# EAGLE design 2in-2out_1.0c (EAGLE 5.05)
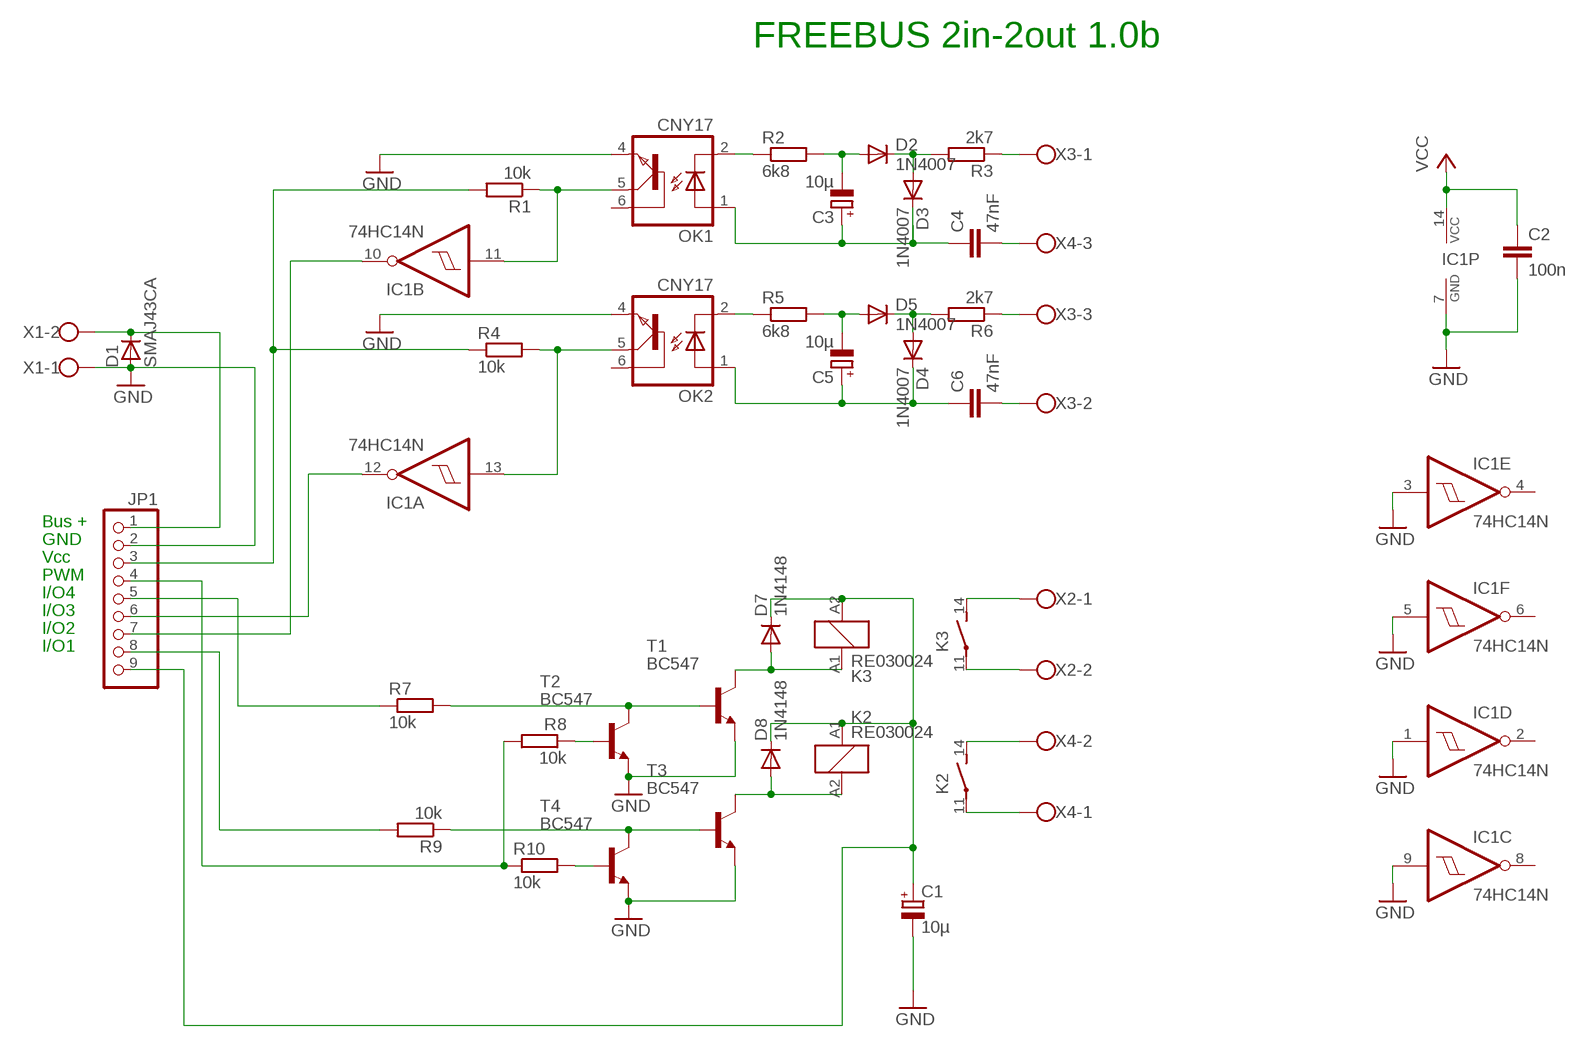
[diagram p0: schematic, sheet 1]

## Parts
C1  10µ  CPOL-EUE3.5-8  [E3,5-8]
C2  100n  C-EU025-024X044  [C025-024X044]
C3  10µ  CPOL-EUE2-4  [E2-4]
C4  47nF  C-EU075-063X106  [C075-063X106]
C5  10µ  CPOL-EUE2-4  [E2-4]
C6  47nF  C-EU075-063X106  [C075-063X106]
D1  SMAJ43CA  D-SMB  [SMB]
D2  1N4007  DIODE-D-2.5  [D-2.5]
D3  1N4007  DIODE-D-2.5  [D-2.5]
D4  1N4007  DIODE-D-2.5  [D-2.5]
D5  1N4007  DIODE-D-2.5  [D-2.5]
D7  1N4148  1N4148STEHEND  [D-2.5]
D8  1N4148  1N4148STEHEND  [D-2.5]
IC1  74HC14N  [DIL14]
JP1  PINHD-1X9  [1X09]
K2  RE030024  [RE-SCHRACK]
K3  RE030024  [RE-SCHRACK]
OK1  CNY17  [DIL06]
OK2  CNY17  [DIL06]
R1  10k  R-EU_0207/10  [0207/10]
R2  6k8  R-EU_0207/2V  [0207/2V]
R3  2k7  R-EU_0207/2V  [0207/2V]
R4  10k  R-EU_0207/2V  [0207/2V]
R5  6k8  R-EU_0207/2V  [0207/2V]
R6  2k7  R-EU_0207/2V  [0207/2V]
R7  10k  R-EU_0207/2V  [0207/2V]
R8  10k  R-EU_0207/2V  [0207/2V]
R9  10k  R-EU_0207/2V  [0207/2V]
R10  10k  R-EU_0207/10  [0207/10]
T1  BC547  [TO92]
T2  BC547  [TO92]
T3  BC547  [TO92]
T4  BC547  [TO92]
X1  W237-02P  [W237-132]
X2  W237-02P  [W237-132]
X3  W237-3E  [W237-3E]
X4  W237-3E  [W237-3E]

## Nets
GND: C1.- C2.2 D1.2(A) IC1.1(D:I) IC1.3(E:I) IC1.5(F:I) IC1.7(P:GND) IC1.9(C:I) JP1.2 OK1.4(EMI) OK2.4(EMI) T1.1(E) T2.1(E) T3.1(E) T4.1(E) X1.1
IO1: JP1.8 R9.2
IO2: IC1.10(B:O) JP1.7
IO3: IC1.12(A:O) JP1.6
IO4: JP1.5 R7.1
N$1: OK1.2(C) R2.1
N$2: K3.11(2:P) X2.2
N$3: C3.- D2.A R2.2
N$4: D1.1(C) JP1.1 X1.2
N$5: D2.C D3.A R3.2
N$6: K3.14(2:S) X2.1
N$8: K2.14(2:S) X4.2
N$9: K2.11(2:P) X4.1
N$10: OK2.2(C) R5.1
N$11: R6.1 X3.3
N$13: C5.- D5.A R5.2
N$14: R7.2 T1.2(B) T2.3(C)
N$15: R3.1 X3.1
N$17: R9.1 T3.2(B) T4.3(C)
N$18: D4.A D5.C R6.2
N$19: D8.A K2.A2 T3.3(C)
N$20: C5.+ C6.1 D4.C OK2.1(A)
N$21: R8.1 T2.2(B)
N$22: R10.2 T4.2(B)
N$23: C6.2 X3.2
N$24: C3.+ C4.1 D3.C OK1.1(A)
N$25: C4.2 X4.3
N$28: IC1.13(A:I) OK2.5(COL) R4.2
N$29: IC1.11(B:I) OK1.5(COL) R1.1
PWM: JP1.4 R8.2 R10.1
R3: D7.A K3.A1 T1.3(C)
VCC: C2.1 IC1.14(P:VCC) JP1.3 R1.2 R4.1
VDD_IN: C1.+ D7.C D8.C JP1.9 K2.A1 K3.A2
Unconnected: IC1.2(D:O) IC1.4(E:O) IC1.6(F:O) IC1.8(C:O) OK1.6(BAS) OK2.6(BAS)

## Notes on the sheet
- FREEBUS 2in-2out 1.0b
- Bus +
- GND
- Vcc
- PWM
- I/O4
- I/O3
- I/O2
- I/O1

## Library data of the parts
C1 C3 C5 = rcl:CPOL-EU: POLARIZED CAPACITOR, European symbol
C2 C4 C6 = rcl:C-EU: CAPACITOR, European symbol
D1 = semicon-smd-ipc:D-: DIODE unfilled
D2-D5 = diode:DIODE-: DIODE
D7 D8 = diode:1N4148: DIODE high speed (Philips)
IC1 = 74xx-eu:74*14: Hex schmitt trigger INVERTER
JP1 = pinhead:PINHD-1X9: PIN HEADER
K2 K3 = relay:RE03*: Miniature PCB Relay 1 pole 6 A SCHRACK Source: http://www.schrack.com/.. 5812.pdf
OK1 OK2 = optocoupler:CNY17: SIEMENS OPTO COUPLER
R1-R10 = rcl:R-EU_: RESISTOR, European symbol
T1-T4 = transistor-npn:BC547*: NPN Transistor
X1 X2 = con-wago-508:W237-02P: WAGO SREW CLAMP
X3 X4 = con-wago-508:W237-3E: WAGO SREW CLAMP

## Board
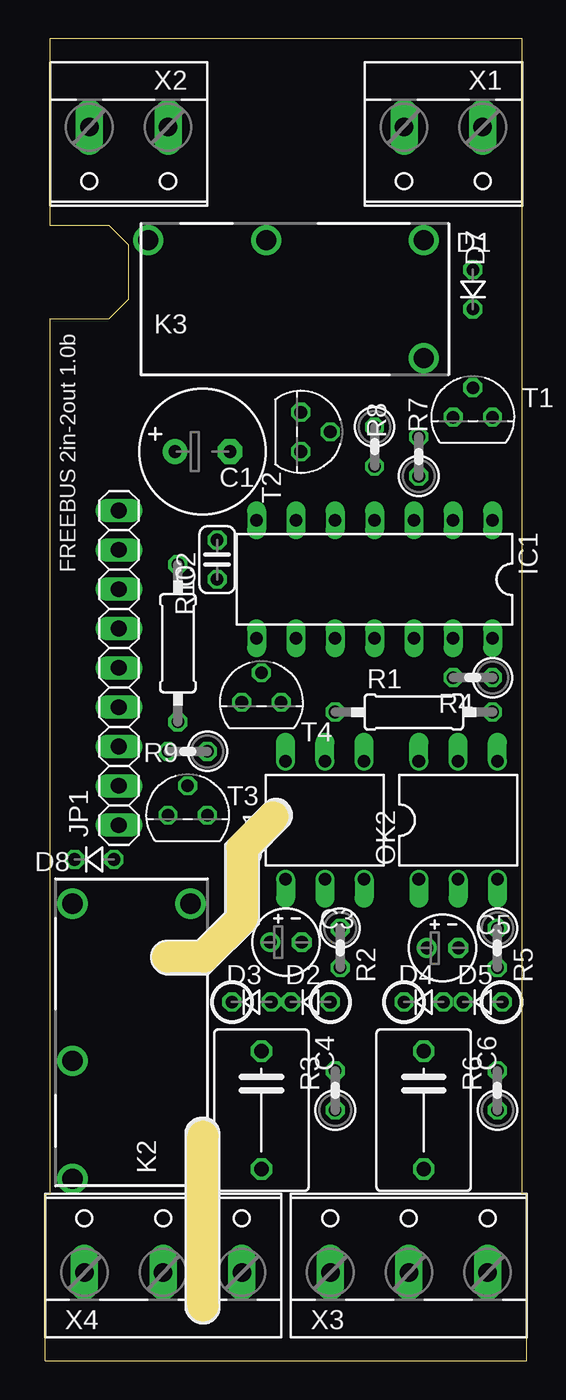
[diagram p1: board, top side]
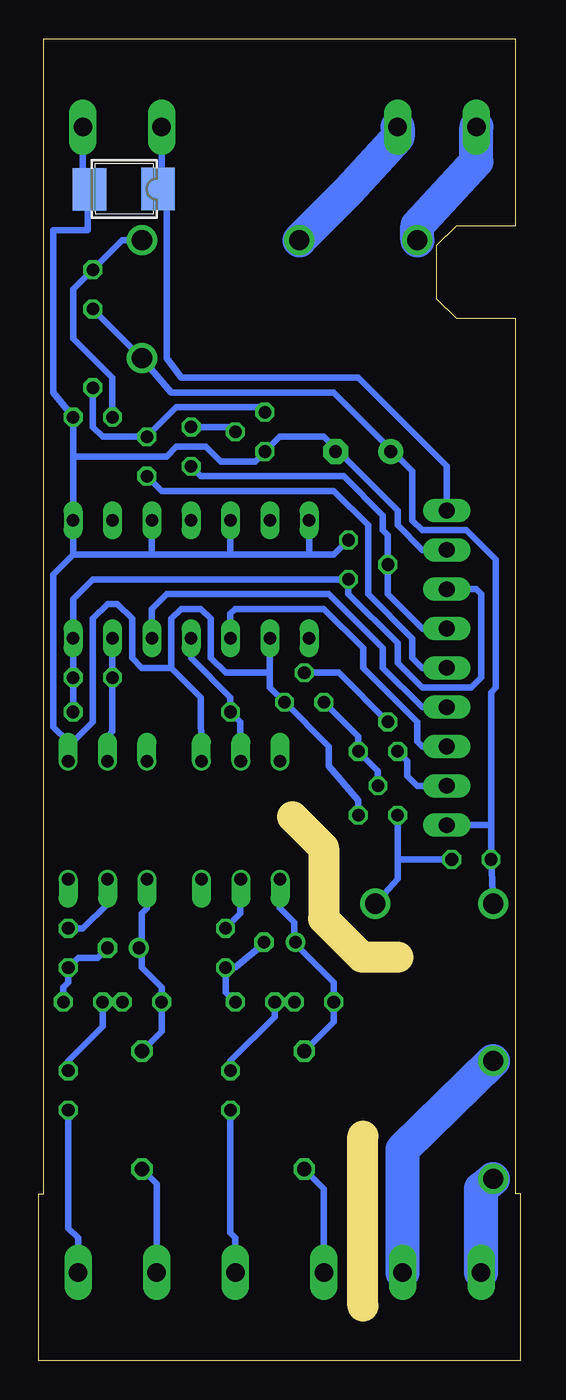
[diagram p2: board, bottom side, seen from below]

Size 31.11 x 85.41 mm. Coordinates in mm from the lower left corner, seen from the top.
Outline: 0,0 0,10.79 0.32,10.79 0.32,67.31 4.13,67.31 5.4,68.58 5.4,72.07 4.13,73.34 0.32,73.34 0.32,85.41 30.8,85.41 30.8,10.79 31.11,10.79 31.11,0 0,0
Copper layers (1*16): Top 0.035mm / dielectric 1.5mm / Bottom 0.035mm
Design rules "ZWILLING": minimum track width 0.2mm, minimum drill 0.5mm, track to track 0.2mm, track to pad 0.2mm, pad to pad 0.2mm, via to via 0.2mm, smd to smd 0mil, copper to edge 0.2mm, drill to drill 0.2mm, minimum pad ring 0.2mm, minimum via ring 0.2mm, stop-mask expansion 0.1mm, vias tented up to drill 0mil, thermal gap 10mil
Milling: 5 lines

### Footprints (pad centres in the part's own frame; a part is rotated, then mirrored left to right if it is on the bottom)
E3,5-8 = drill 0.813 pad 1.6 round: + -1.778,0 | drill 0.813 pad 1.6 octagon: - 1.778,0
C025-024X044 = drill 0.813 octagon: 1 -1.27,0; 2 1.27,0
E2-4 = drill 0.813 pad 1.27 round: + -1.016,0 | drill 0.813 pad 1.27 octagon: - 1.016,0
C075-063X106 = drill 0.914 octagon: 1 -3.81,0; 2 3.81,0
SMB = smd 2.159 x 2.743: 1 -2.311,-0.127; 2 2.108,-0.102
D-2.5 = drill 0.813 octagon: A 1.27,0; C -1.27,0
DIL14 = drill 0.813 long: 1 -7.62,-3.81; 2 -5.08,-3.81; 3 -2.54,-3.81; 4 0,-3.81; 5 2.54,-3.81; 6 5.08,-3.81; 7 7.62,-3.81; 8 7.62,3.81; 9 5.08,3.81; 10 2.54,3.81; 11 0,3.81; 12 -2.54,3.81; 13 -5.08,3.81; 14 -7.62,3.81
1X09 = drill 1.016 long: 1 -10.16,0; 2 -7.62,0; 3 -5.08,0; 4 -2.54,0; 5 0,0; 6 2.54,0; 7 5.08,0; 8 7.62,0; 9 10.16,0
RE-SCHRACK = drill 1.3 round: 11 8.89,-3.81; 14 1.27,-3.81; A1 -8.89,-3.81; A2 -8.89,3.81
DIL06 = drill 0.813 offset: 1 -2.54,-3.81; 2 0,-3.81; 3 2.54,-3.81; 4 2.54,3.81; 5 0,3.81; 6 -2.54,3.81
0207/10 = drill 0.813 octagon: 1 -5.08,0; 2 5.08,0
0207/2V = drill 0.813 octagon: 1 -1.27,0; 2 1.27,0
TO92 = drill 0.813 octagon: 1 1.27,0; 2 0,1.905; 3 -1.27,0
W237-132 = drill 1.194 long: 1 -2.54,-0.635; 2 2.54,-0.635
W237-3E = drill 1.194 long: 1 -5.08,-0.635; 2 0,-0.635; 3 5.08,-0.635

### Placement (x,y rotation side)
C1  10.16,58.74 0 top
C2  11.11,51.75 90 top
C3  15.56,27.04 0 top
C4  13.97,16.19 270 top
C5  25.67,26.67 0 top
C6  24.45,16.19 270 top
D1  25.72,75.56 180 bottom
D2  17.14,23.18 0 top
D3  13.34,23.18 0 top
D4  24.45,23.18 0 top
D5  28.26,23.18 0 top
D7  27.62,69.22 90 top
D8  3.17,32.38 0 top
IC1  21.27,50.48 180 top
JP1  4.76,44.77 270 top
K2  5.58,20.64 270 top
K3  15.56,68.58 180 top
OK1  18.07,34.92 0 top
OK2  26.67,34.92 0 top
R1  23.81,41.91 0 top
R2  19.05,26.67 270 top
R3  18.73,17.46 90 top
R4  27.62,44.13 180 top
R5  29.21,26.67 270 top
R6  29.21,17.46 90 top
R7  24.13,58.42 90 top
R8  21.27,59.05 270 top
R9  9.21,39.37 180 top
R10  8.57,46.36 270 top
T1  27.62,60.96 0 top
T2  16.51,60.01 270 top
T3  9.21,35.24 0 top
T4  13.97,42.55 0 top
X1  25.72,79.06 180 top
X2  5.4,79.06 180 top
X3  23.49,6.35 0 top
X4  7.62,6.35 0 top

### Tracks (layer width: path | path; a pad name or v marks a point on that pad's centre or on a via)
GND
  Bottom 0.406: T3.1 10.48,36.2 12.38,38.42 12.38,39.69 T4.1 16.19,43.5 16.19,44.45 | 29.21,40.01 30.16,40.96 30.16,50.8 28.89,52.07 | 11.75,58.74 12.7,59.69 15.56,59.69 T2.1 17.15,58.1 19.37,58.1 20.32,59.05 22.22,59.05 22.86,58.42 28.89,58.42 | 11.75,58.74 C1.- | 11.75,58.74 7.94,54.93 7.94,53.98 6.35,52.39 JP1.2 | 22.54,44.77 22.54,47.94 21.91,48.58 20.64,48.58 20,47.94 20,45.4 19.05,44.45 16.19,44.45 | 22.54,44.77 24.45,44.77 25.08,45.4 25.08,47.94 26.04,48.9 26.67,48.9 27.62,47.94 27.62,41.28 28.89,40.01 29.21,40.01 | 29.21,40.01 OK2.4 | OK1.4 20.64,42.86 22.54,44.77 | 13.65,52.07 IC1.7 | 28.89,52.07 23.81,52.07 | 23.81,52.07 18.73,52.07 | 18.73,52.07 13.65,52.07 | 18.73,52.07 IC1.5 | 23.81,52.07 IC1.3 | 28.89,52.07 IC1.1 28.89,58.42 | 16.19,44.45 IC1.9 | 13.65,52.07 12.07,52.07 C2.2 | 28.89,58.42 T1.1 30.16,62.55 30.16,73.03 27.94,73.03 27.94,75.67 | 27.94,75.67 27.94,75.88 | 27.94,75.67 D1.2 28.26,75.67 X1.1
IO1
  Bottom 0.406: R9.2 7.3,38.73 7.3,37.78 6.67,37.15 JP1.8
IO2
  Bottom 0.406: IC1.10 18.73,48.26 18.42,48.58 12.7,48.58 10.16,46.04 10.16,44.77 6.67,41.28 6.67,40.01 6.35,39.69 JP1.7
IO3
  Bottom 0.406: IC1.12 23.81,48.58 22.86,49.53 12.38,49.53 8.89,46.04 8.89,44.77 6.35,42.23 JP1.6
IO4
  Bottom 0.406: JP1.5 6.35,44.77 6.99,45.4 6.99,46.67 9.84,49.53 9.84,53.98 12.07,56.2 23.18,56.2 R7.1
N$1
  Bottom 0.406: OK1.2 18.1,31.11 18.1,28.89 R2.1
N$2
  Bottom 2.184: K3.11 6.67,73.34 2.86,77.47 X2.2
N$3
  Bottom 0.406: D2.A 19.05,23.81 R2.2 18.42,25.4 16.51,26.99 16.51,27.04 C3.-
N$4
  Bottom 0.305: 22.86,76.01 23.18,76.2 D1.1
  Bottom 0.406: 22.86,76.01 22.86,64.77 21.91,63.5 10.48,63.5 4.76,57.79 JP1.1 | 23.18,76.2 X1.2
N$5
  Bottom 0.406: R3.2 18.73,19.37 15.87,22.22 D2.C D3.A
N$6
  Bottom 2.184: K3.14 11.11,75.56 7.94,79.06 X2.1
N$8
  Bottom 2.184: K2.14 7.62,13.65 X4.2
N$9
  Bottom 2.184: K2.11 2.54,11.11 X4.1
N$10
  Bottom 0.406: R5.1 28.26,27.94 26.67,29.53 OK2.2
N$11
  Bottom 0.406: X3.3 28.58,7.94 29.21,8.57 R6.1
N$13
  Bottom 0.406: D5.A 29.53,24.13 29.21,24.45 R5.2 28.58,26.04 27.31,26.04 C5.-
N$14
  Bottom 0.406: T2.3 16.83,61.59 22.22,61.59 R7.2 26.99,59.69 27.62,60.33 T1.2
N$15
  Bottom 0.406: X3.1 18.42,7.94 18.73,8.26 R3.1
N$17
  Bottom 0.406: T3.2 9.21,38.1 R9.1 10.48,40.32 T4.3
N$18
  Bottom 0.406: D4.A D5.C 26.99,21.59 29.21,19.37 R6.2
N$19
  Bottom 0.406: 7.94,32.38 7.94,31.11 K2.A2 | D8.A 7.94,32.38 | 7.94,32.38 T3.3
N$20
  Bottom 0.406: C6.1 23.18,21.27 D4.C 23.18,24.13 24.45,25.4 24.45,26.67 | 24.45,26.67 C5.+ | 24.45,26.67 24.45,28.89 24.13,29.21 OK2.1
N$21
  Bottom 0.406: T2.2 18.73,60.33 R8.1
N$22
  Bottom 0.406: R10.2 11.75,44.45 T4.2
N$23
  Bottom 0.406: X3.2 23.49,11.43 C6.2
N$24
  Bottom 0.406: C4.1 12.07,21.91 D3.C 12.07,24.45 14.6,26.99 14.6,27.04 | OK1.1 15.56,31.11 15.56,29.26 14.6,28.31 14.6,27.04 | 14.6,27.04 C3.+
N$25
  Bottom 0.406: X4.3 12.7,11.11 C4.2
N$28
  Bottom 0.406: OK2.5 26.67,40.32 26.35,40.64 R4.2 IC1.13
N$29
  Bottom 0.406: IC1.11 21.27,45.4 18.73,42.86 R1.1 18.1,41.28 18.1,38.73 OK1.5
PWM
  Bottom 0.406: JP1.4 6.35,47.31 8.57,49.53 R10.1 8.57,53.34 8.89,53.66 8.89,54.61 11.43,57.15 20.64,57.15 R8.2
R3
  Bottom 0.406: K3.A1 25.72,72.39 D7.A 28.89,69.22 28.89,66.04 26.35,63.5 T1.3
VCC
  Bottom 0.406: R1.2 R4.1 IC1.14 28.89,49.21 27.62,50.48 C2.1 11.11,49.53 7.94,46.36 7.94,45.09 6.35,43.5 3.17,43.5 2.54,44.13 2.54,49.53 2.86,49.85 JP1.3
VDD_IN
  Bottom 0.406: K2.A1 D8.C 1.9,34.61 | 1.9,34.61 JP1.9 | 8.26,58.74 6.99,57.47 6.99,54.29 6.35,53.66 3.49,53.66 1.59,51.75 1.59,43.5 1.9,43.18 1.9,34.61 | 8.26,58.74 C1.+ | 8.26,58.74 12.07,62.55 22.54,62.55 K3.A2 D7.C

### Text on the board
tNames: FREEBUS 2in-2out 1.0b